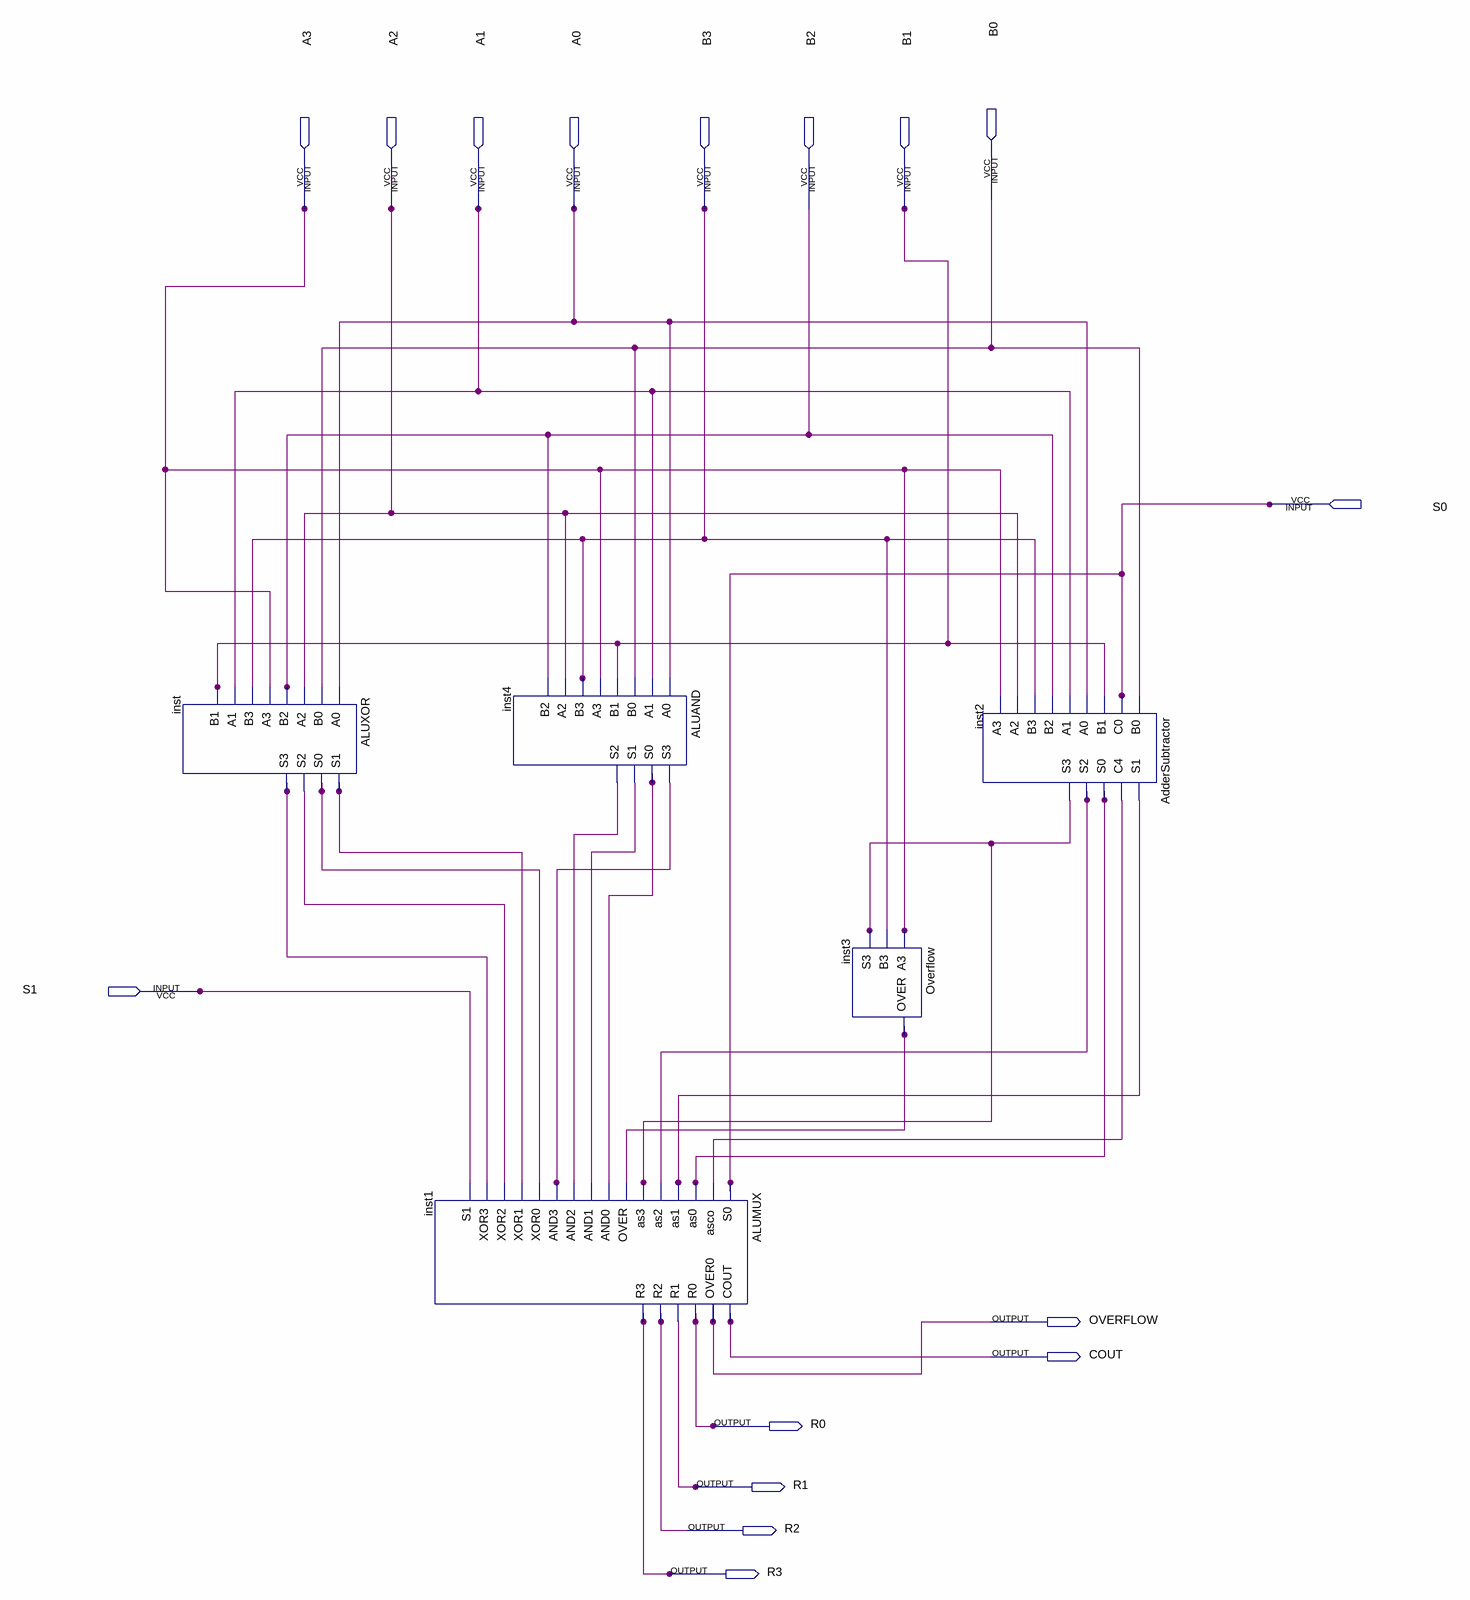
[diagram p0: schematic sheet]
// Quartus schematic ALU.bdf as structural Verilog: 5 symbols, 16 pins
module ALU (
  input  B0,
  input  A3,
  input  A2,
  input  A1,
  input  A0,
  input  B3,
  input  B2,
  input  B1,
  input  S0,
  input  S1,
  output OVERFLOW,
  output COUT,
  output R0,
  output R1,
  output R2,
  output R3
);

  wire inst2_c4, inst2_s0, inst2_s1, inst2_s2, inst2_s3, inst3_over, inst4_s0, inst4_s1, inst4_s2, inst4_s3,
       inst_s0, inst_s1, inst_s2, inst_s3;

  ALUXOR inst (
    .A0(A0), .B0(B0), .A2(A2), .B2(B2), .A3(A3), .B3(B3), .A1(A1), .B1(B1), .S1(inst_s1), .S0(inst_s0),
    .S2(inst_s2), .S3(inst_s3));
  ALUMUX inst1 (
    .S0(S0), .asco(inst2_c4), .as0(inst2_s0), .as1(inst2_s1), .as2(inst2_s2), .as3(inst2_s3),
    .OVER(inst3_over), .AND0(inst4_s0), .AND1(inst4_s1), .AND2(inst4_s2), .AND3(inst4_s3), .XOR0(inst_s0),
    .XOR1(inst_s1), .XOR2(inst_s2), .XOR3(inst_s3), .S1(S1), .COUT(COUT), .OVER0(OVERFLOW), .R0(R0), .R1(R1),
    .R2(R2), .R3(R3));
  ALUAND inst4 (
    .A0(A0), .A1(A1), .B0(B0), .B1(B1), .A3(A3), .B3(B3), .A2(A2), .B2(B2), .S3(inst4_s3), .S0(inst4_s0),
    .S1(inst4_s1), .S2(inst4_s2));
  Overflow inst3 (.A3(A3), .B3(B3), .S3(inst2_s3), .OVER(inst3_over));
  AdderSubtractor inst2 (
    .B0(B0), .C0(S0), .B1(B1), .A0(A0), .A1(A1), .B2(B2), .B3(B3), .A2(A2), .A3(A3), .S1(inst2_s1),
    .C4(inst2_c4), .S0(inst2_s0), .S2(inst2_s2), .S3(inst2_s3));
endmodule
